# EAGLE design zerofat2 (EAGLE 7.5.0)
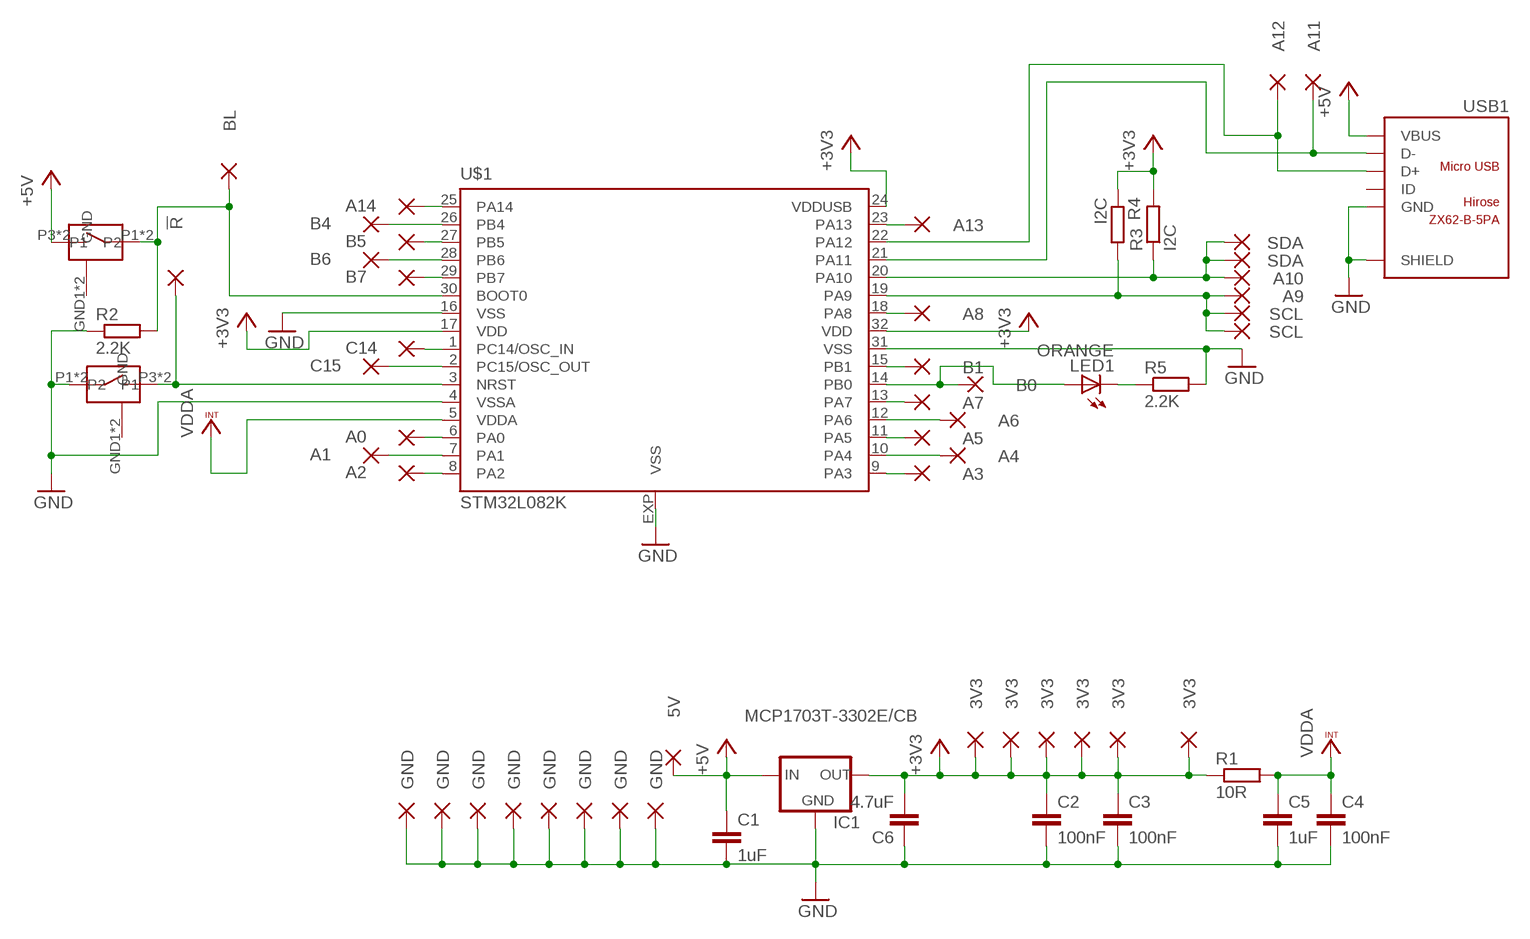
[diagram p0: schematic, sheet 1]

## Parts
B  EVQPT5A15  [EVQPT5A15]
C1  1uF  C-EUC0603  [C0603]
C2  100nF  C-EUC0603  [C0603]
C3  100nF  C-EUC0603  [C0603]
C4  100nF  C-EUC0603  [C0603]
C5  1uF  C-EUC0603  [C0603]
C6  4.7uF  C-EUC0603  [C0603]
IC1  MCP1703T-3302E/CB  XC63FPM  [SOT23]
LED1  ORANGE  LEDCHIP-LED0603  [CHIP-LED0603]
PAD1  SCL  SMD2  [PAD_MINIMAL]
PAD2  SDA  SMD2  [PAD_MINIMAL]
PAD3  C14  SMD2  [PAD_MINIMAL]
PAD4  C15  SMD2  [PAD_MINIMAL]
PAD5  GND  SMD2  [PAD_MINIMAL]
PAD6  !R  SMD2  [PAD_MINIMAL]
PAD7  3V3  SMD2  [PAD_MINIMAL]
PAD8  A0  SMD2  [PAD_MINIMAL]
PAD9  A2  SMD2  [PAD_MINIMAL]
PAD10  A1  SMD2  [PAD_MINIMAL]
PAD11  A3  SMD2  [PAD_MINIMAL]
PAD12  A5  SMD2  [PAD_MINIMAL]
PAD13  A7  SMD2  [PAD_MINIMAL]
PAD14  B1  SMD2  [PAD_MINIMAL]
PAD15  3V3  SMD2  [PAD_MINIMAL]
PAD16  A4  SMD2  [PAD_MINIMAL]
PAD17  A6  SMD2  [PAD_MINIMAL]
PAD18  B0  SMD2  [PAD_MINIMAL]
PAD19  SDA  SMD2  [PAD_MINIMAL]
PAD20  SCL  SMD2  [PAD_MINIMAL]
PAD21  3V3  SMD2  [PAD_MINIMAL]
PAD22  GND  SMD2  [PAD_MINIMAL]
PAD24  A8  SMD2  [PAD_MINIMAL]
PAD25  A9  SMD2  [PAD_MINIMAL]
PAD26  A10  SMD2  [PAD_MINIMAL]
PAD27  A13  SMD2  [PAD_MINIMAL]
PAD29  A12  SMD2  [PAD_MINIMAL]
PAD30  A11  SMD2  [PAD_MINIMAL]
PAD31  A14  SMD2  [PAD_MINIMAL]
PAD33  B5  SMD2  [PAD_MINIMAL]
PAD34  B7  SMD2  [PAD_MINIMAL]
PAD35  BL  SMD2  [PAD_MINIMAL]
PAD36  B6  SMD2  [PAD_MINIMAL]
PAD37  B4  SMD2  [PAD_MINIMAL]
PAD39  GND  SMD2  [PAD_MINIMAL]
PAD43  GND  SMD2  [PAD_MINIMAL]
PAD45  5V  SMD2  [PAD_MINIMAL]
PAD48  GND  SMD2  [PAD_MINIMAL]
PAD49  GND  SMD2  [PAD_MINIMAL]
PAD50  GND  SMD2  [PAD_MINIMAL]
PAD51  GND  SMD2  [PAD_MINIMAL]
PAD52  3V3  SMD2  [PAD_MINIMAL]
PAD53  3V3  SMD2  [PAD_MINIMAL]
PAD54  3V3  SMD2  [PAD_MINIMAL]
R  EVQPT5A15  [EVQPT5A15]
R1  10R  R-EU_R0603  [R0603]
R2  2.2K  R-EU_R0603  [R0603]
R3  I2C  R-EU_R0603  [R0603]
R4  I2C  R-EU_R0603  [R0603]
R5  2.2K  R-EU_R0603  [R0603]
U$1  STM32L082K  [UFQFPN32]
USB1  ZX62-B-5PA  MICRO-USB-SMD(ZX62-B-5PA)  [MICRO-USB5+6P-SMD-0.65-AB]

## Nets
+3V3 [PWR]: C2.1 C3.1 C6.2 IC1.2(OUT) PAD7.1(P) PAD15.1(P) PAD21.1(P) PAD52.1(P) PAD53.1(P) PAD54.1(P) R1.1 R3.2 R4.1 U$1.17(VDD) U$1.24(VDDUSB) U$1.32(VDD)
+5V: B.P3(P2) B.P4(P2) C1.1 IC1.3(IN) PAD45.1(P) USB1.1(VBUS)
BOOT0: B.P1 B.P2(P1) PAD35.1(P) R2.2 U$1.30(BOOT0)
GND: C1.2 C2.2 C3.2 C4.2 C5.2 C6.1 IC1.1(GND) PAD5.1(P) PAD22.1(P) PAD39.1(P) PAD43.1(P) PAD48.1(P) PAD49.1(P) PAD50.1(P) PAD51.1(P) R2.1 R5.2 R.P1 R.P2(P1) U$1.4(VSSA) U$1.16(VSS) U$1.31(VSS) U$1.EXP(VSS) USB1.5(GND) USB1.P1(SHIELD) USB1.P2(SHIELD) USB1.P3(SHIELD) USB1.P4(SHIELD) USB1.P5(SHIELD) USB1.P6(SHIELD)
N$1: PAD30.1(P) U$1.21(PA11) USB1.2(D-)
N$2: LED1.A PAD18.1(P) U$1.14(PB0)
N$3: PAD27.1(P) U$1.23(PA13)
N$4: PAD29.1(P) U$1.22(PA12) USB1.3(D+)
N$5: PAD31.1(P) U$1.25(PA14)
N$6: PAD3.1(P) U$1.1(PC14/OSC_IN)
N$7: PAD37.1(P) U$1.26(PB4)
N$8: PAD33.1(P) U$1.27(PB5)
N$9: PAD36.1(P) U$1.28(PB6)
N$10: PAD4.1(P) U$1.2(PC15/OSC_OUT)
N$11: PAD8.1(P) U$1.6(PA0)
N$12: PAD10.1(P) U$1.7(PA1)
N$13: PAD9.1(P) U$1.8(PA2)
N$14: PAD11.1(P) U$1.9(PA3)
N$15: PAD16.1(P) U$1.10(PA4)
N$16: PAD12.1(P) U$1.11(PA5)
N$17: PAD17.1(P) U$1.12(PA6)
N$18: PAD13.1(P) U$1.13(PA7)
N$19: PAD24.1(P) U$1.18(PA8)
N$20: PAD14.1(P) U$1.15(PB1)
N$21: PAD1.1(P) PAD20.1(P) PAD25.1(P) R4.2 U$1.19(PA9)
N$22: PAD34.1(P) U$1.29(PB7)
N$23: PAD2.1(P) PAD19.1(P) PAD26.1(P) R3.1 U$1.20(PA10)
N$41: LED1.C R5.1
N$45: PAD6.1(P) R.P3(P2) R.P4(P2) U$1.3(NRST)
VCCINT: C4.1 C5.1 R1.2 U$1.5(VDDA) ; supply symbol labelled VDDA
Unconnected: B.GND1(GND) B.GND2(GND) R.GND1(GND) R.GND2(GND) USB1.4(ID)

## Library data of the parts
B R = zerofat:EVQPT5A15: Panasonic EVQPT5A15 4.9 mm Square SMD Light Touch Switch
C1-C6 = rcl:C-EU: CAPACITOR, European symbol
IC1 = v-reg:XC63FP: Positiv Voltage Regulators www.torex.co.jp/english/product/pro02/pdf/0201_xc62fp.pdf
LED1 = led:LED: LED OSRAM: - CHIPLED LG R971, LG N971, LY N971, LG Q971, LY Q971, LO R971, LY R971 LH N974, LH R974 LS Q976, LO Q976, LY Q976 LO Q996 - Hyper CHIPLED LW Q18S LB Q993, LB Q99A, LB R99A - SideLED LS A670, LO A670, LY A670, LG A670, LP A670 LB A673, LV A673, LT A673, LW A673 LH A674 LY A675 LS A676, LA A676, LO A676, LY A676, LW A676 LS A679, LY A679, LG A679 - Hyper Micro SIDELED® LS Y876, LA Y876, LO Y876, LY Y876 LT Y87S - SmartLED LW L88C, LW L88S LB L89C, LB L89S, LG L890 LS L89K, LO L89K, LY L89K LS L896, LA L896, LO L896, LY L896 - TOPLED LS T670, LO T670, LY T670, LG T670, LP T670 LSG T670, LSP T670, LSY T670, LOP T670, LYG T670 LG T671, LOG T671, LSG T671 LB T673, LV T673, LT T673, LW T673 LH T674 LS T676, LA T676, LO T676, LY T676, LB T676, LH T676, LSB T676, LW T676 LB T67C, LV T67C, LT T67C, LS T67K, LO T67K, LY T67K, LW E67C LS E67B, LA E67B, LO E67B, LY E67B, LB E67C, LV E67C, LT E67C LW T67C LS T679, LY T679, LG T679 LS T770, LO T770, LY T770, LG T770, LP T770 LB T773, LV T773, LT T773, LW T773 LH T774 LS E675, LA E675, LY E675, LS T675 LS T776, LA T776, LO T776, LY T776, LB T776 LHGB T686 LT T68C, LB T68C - Hyper Mini TOPLED® LB M676 - Mini TOPLED Santana® LG M470 LS M47K, LO M47K, LY M47K Source: http://www.osram.convergy.de LUXEON: - LUMILED® LXK2-PW12-R00, LXK2-PW12-S00, LXK2-PW14-U00, LXK2-PW14-V00 LXK2-PM12-R00, LXK2-PM12-S00, LXK2-PM14-U00 LXK2-PE12-Q00, LXK2-PE12-R00, LXK2-PE12-S00, LXK2-PE14-T00, LXK2-PE14-U00 LXK2-PB12-K00, LXK2-PB12-L00, LXK2-PB12-M00, LXK2-PB14-N00, LXK2-PB14-P00, LXK2-PB14-Q00 LXK2-PR12-L00, LXK2-PR12-M00, LXK2-PR14-Q00, LXK2-PR14-R00 LXK2-PD12-Q00, LXK2-PD12-R00, LXK2-PD12-S00 LXK2-PH12-R00, LXK2-PH12-S00 LXK2-PL12-P00, LXK2-PL12-Q00, LXK2-PL12-R00 Source: www.luxeon.com KINGBRIGHT: KA-3528ASYC Source: www.kingbright.com
PAD1-PAD22 PAD24-PAD27 PAD29-PAD31 PAD33-PAD37 PAD39 PAD43 PAD45 PAD48-PAD54 = zerofat:SMD2: SMD PAD
R1-R5 = rcl:R-EU_: RESISTOR, European symbol
U$1 = zerofat:STM32L082K: STM32L082K[ZB] Ultra-low-power ARM Cortex M0 32MHz platform 1.65 V to 3.6 V power supply Up to 192 KB Flash + 20KB RAM + 6 KB EEPROM 2x 12-bit DACs + 2x comparators + 12bit ADC 7ch DMA, USB 2.0 crystal-less,3x USART, SPI 16, 2 x I2C 11x timers, 2x watchdogs, CRC, RNG, AES 128-bit
USB1 = Seeed-OPL-Connector:MICRO-USB-SMD(ZX62-B-5PA): 320010005; MPN: ZX62-B-5PA

## Net classes
0 default: width 0.2 mm
1 PWR: width 0.2 mm
2 GND: width 0.2 mm

## Board
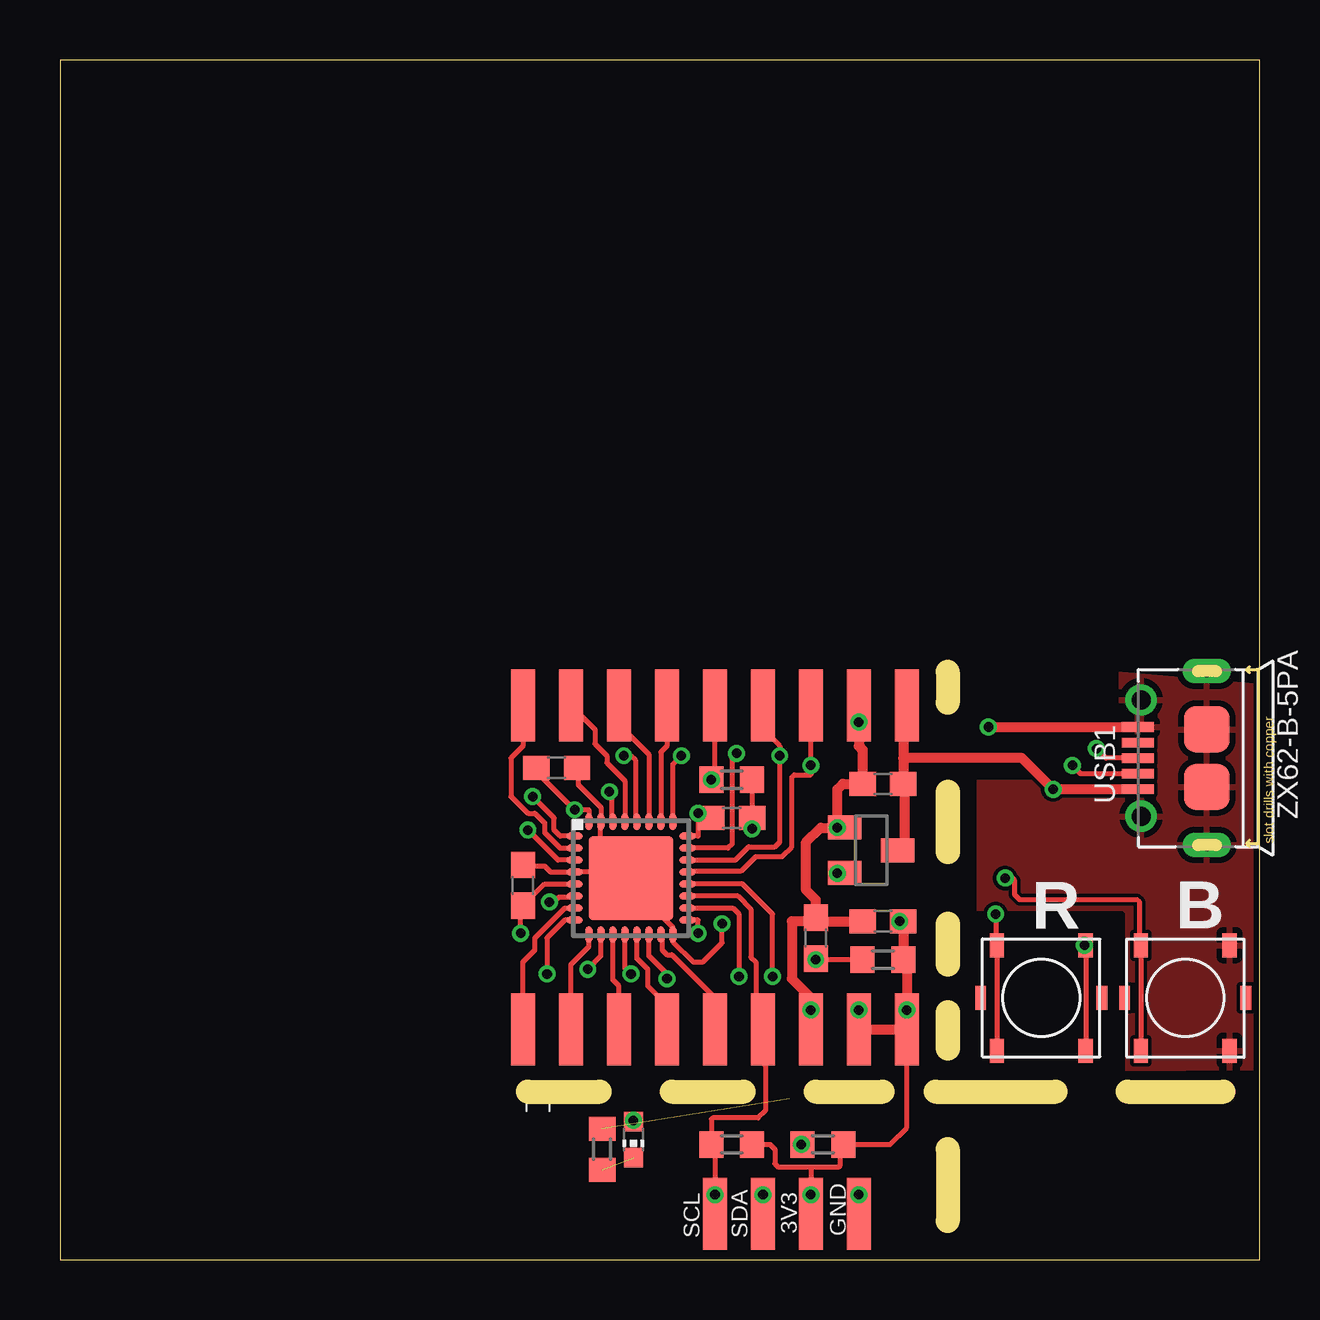
[diagram p1: board, top side]
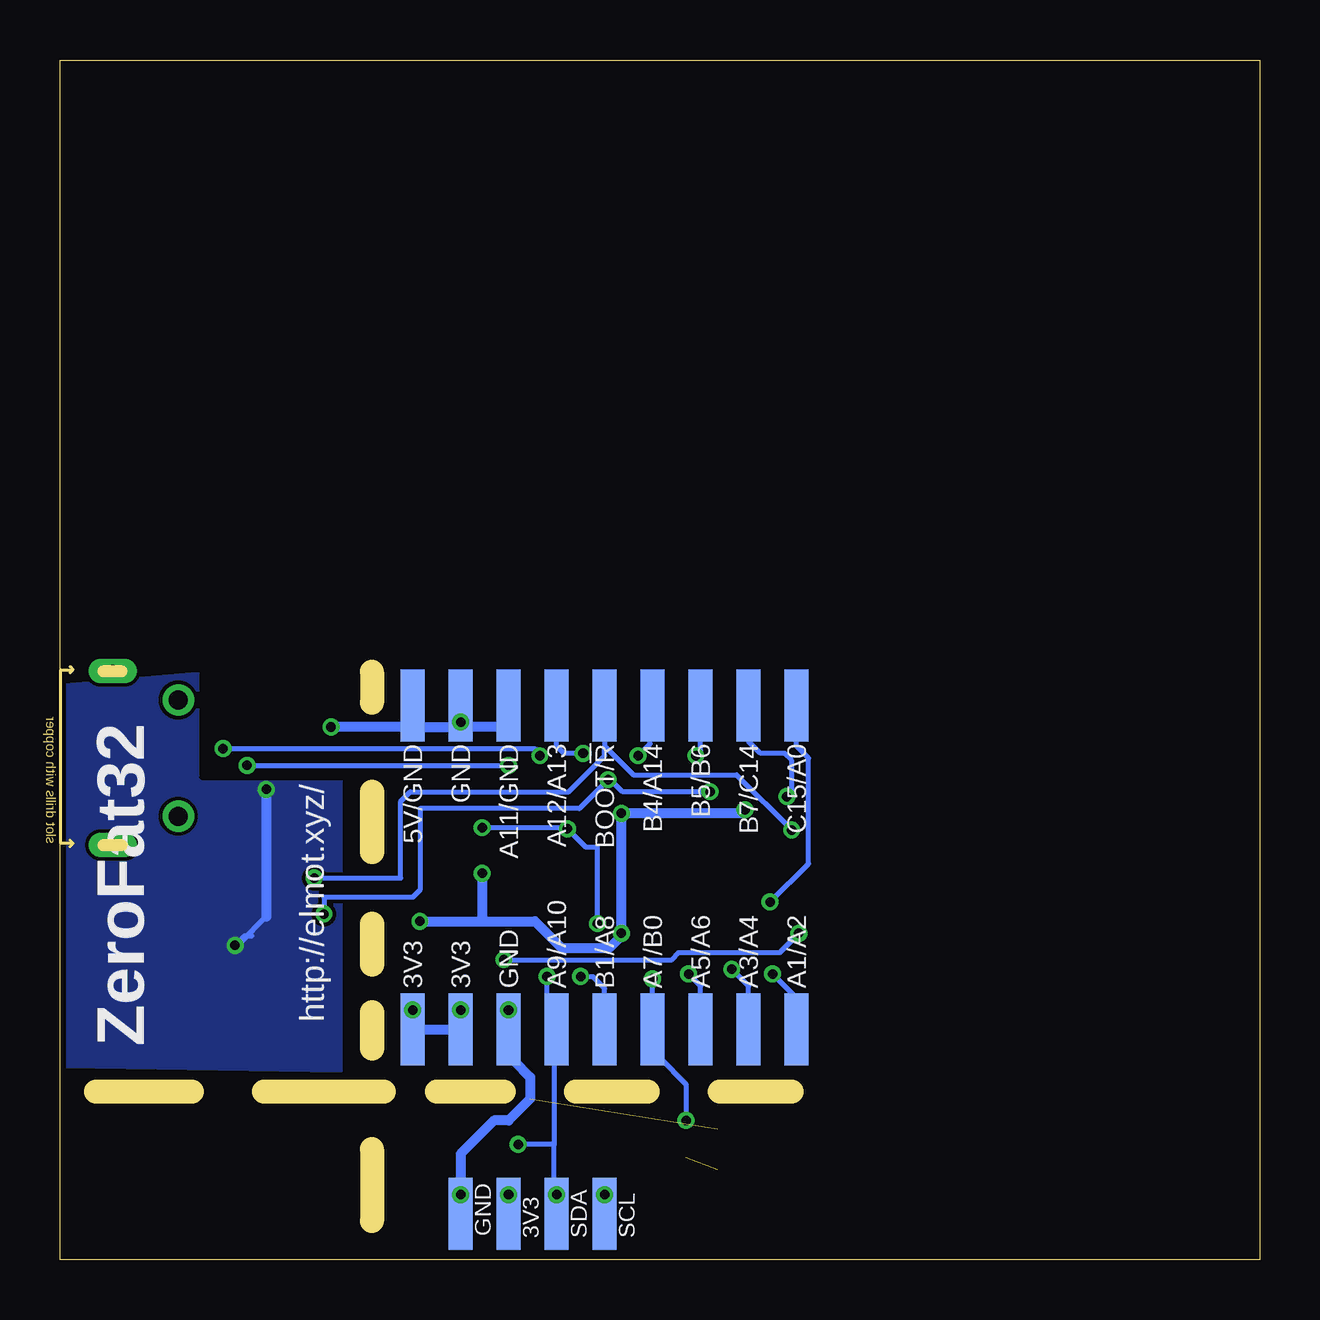
[diagram p2: board, bottom side, seen from below]

Size 50 x 50 mm. Coordinates in mm from the lower left corner, seen from the top.
Outline: 0,0 50,0 50,50 0,50 0,0
Copper layers (1*16): Top 0.035mm / dielectric 1.5mm / Bottom 0.035mm
Design rules "SeeedStudio_2layer_DRU_no_angle_20140221 *": minimum track width 6mil, minimum drill 12mil, track to track 6mil, track to pad 6mil, pad to pad 6mil, via to via 6mil, smd to smd 0mil, copper to edge 10mil, drill to drill 10mil, minimum pad ring 10mil, minimum via ring 6mil, stop-mask expansion 2mil, vias tented up to drill 100mil, thermal gap 10mil
Milling: 10 lines

### Footprints (pad centres in the part's own frame; a part is rotated, then mirrored left to right if it is on the bottom)
EVQPT5A15 = smd 0.45 x 1: GND1 -2.525,0; GND2 2.525,0 | smd 0.6 x 1: P1 -1.85,-2.2; P2 -1.85,2.2; P3 1.85,2.2; P4 1.85,-2.2
C0603 = smd 1.1 x 1: 1 -0.85,0; 2 0.85,0
SOT23 = smd 1 x 1.4: 1 -0.95,-1.1; 2 0.95,-1.1; 3 0,1.1
CHIP-LED0603 = smd 0.8 x 0.8: A 0,-0.75; C 0,0.75
PAD_MINIMAL = smd 1 x 3: 1 0,0
R0603 = smd 1 x 1.1: 1 -0.85,0; 2 0.85,0
UFQFPN32 = smd 0.7 x 0.3: 1 -2.35,1.75; 2 -2.35,1.25; 3 -2.35,0.75; 4 -2.35,0.25; 5 -2.35,-0.25; 6 -2.35,-0.75; 7 -2.35,-1.25; 8 -2.35,-1.75; 17 2.35,-1.75; 18 2.35,-1.25; 19 2.35,-0.75; 20 2.35,-0.25; 21 2.35,0.25; 22 2.35,0.75; 23 2.35,1.25; 24 2.35,1.75 | smd 0.3 x 0.7: 9 -1.75,-2.35; 10 -1.25,-2.35; 11 -0.75,-2.35; 12 -0.25,-2.35; 13 0.25,-2.35; 14 0.75,-2.35; 15 1.25,-2.35; 16 1.75,-2.35; 25 1.75,2.35; 26 1.25,2.35; 27 0.75,2.35; 28 0.25,2.35; 29 -0.25,2.35; 30 -0.75,2.35; 31 -1.25,2.35; 32 -1.75,2.35 | smd 3.5 x 3.5: EXP 0,0
MICRO-USB5+6P-SMD-0.65-AB = smd 0.4 x 1.35: 1 -1.3,2.875; 2 -0.65,2.875; 3 0,2.875; 4 0.65,2.875; 5 1.3,2.875 | smd 1.9 x 1.9: P1 -1.2,0; P2 1.2,0 | drill 0.508 pad 1.016 long: P3 -3.625,0; P4 3.625,0 | drill 0.8: P5 -2.425,2.73; P6 2.425,2.73

### Placement (x,y rotation side)
B  40.9,10.9 0 top
C1  34.3,19.83 180 top
C2  20.7,20.5 0 top
C3  28,18.4 0 top
C4  19.3,15.6 90 top
C5  31.5,13.4 90 top
C6  34.3,14.1 0 top
IC1  33.81,17.06 270 top
LED1  23.9,5 180 top
PAD1  27.3,1.9 0 top
PAD2  29.3,1.9 0 top
PAD3  21.3,23.1 0 bottom
PAD4  19.3,23.1 0 top
PAD5  35.3,23.1 0 bottom
PAD6  27.3,23.1 180 bottom
PAD7  35.3,9.6 0 bottom
PAD8  19.3,23.1 0 bottom
PAD9  19.3,9.6 0 bottom
PAD10  19.3,9.6 0 top
PAD11  21.3,9.6 180 top
PAD12  23.3,9.6 180 top
PAD13  25.3,9.6 180 top
PAD14  27.3,9.6 180 top
PAD15  35.3,9.6 0 top
PAD16  21.3,9.6 180 bottom
PAD17  23.3,9.6 180 bottom
PAD18  25.3,9.6 180 bottom
PAD19  29.3,1.9 0 bottom
PAD20  27.3,1.9 0 bottom
PAD21  31.3,1.9 0 bottom
PAD22  33.3,1.9 0 bottom
PAD24  27.3,9.6 180 bottom
PAD25  29.3,9.6 180 top
PAD26  29.3,9.6 180 bottom
PAD27  29.3,23.1 180 bottom
PAD29  29.3,23.1 180 top
PAD30  31.3,23.1 180 top
PAD31  25.3,23.1 0 bottom
PAD33  23.3,23.1 0 top
PAD34  21.3,23.1 0 top
PAD35  27.3,23.1 0 top
PAD36  23.3,23.1 0 bottom
PAD37  25.3,23.1 0 top
PAD39  33.3,23.1 0 bottom
PAD43  31.3,9.6 0 top
PAD45  35.3,23.1 0 top
PAD48  31.3,9.6 0 bottom
PAD49  33.3,23.1 0 top
PAD50  31.3,23.1 0 bottom
PAD51  33.3,1.9 0 top
PAD52  33.3,9.6 180 top
PAD53  33.3,9.6 180 bottom
PAD54  31.3,1.9 180 top
R  46.9,10.9 180 top
R1  34.3,12.5 180 top
R2  28,20 180 top
R3  31.8,4.8 0 top
R4  28,4.8 180 top
R5  22.6,4.6 90 top
U$1  23.8,15.9 0 top
USB1  47.8,20.9 90 top

### Tracks (layer width: path | path; a pad name or v marks a point on that pad's centre or on a via)
+3V3  (via drill 0.4)
  Top 0.2: 26.2,14.2 U$1.17 26.6,14.15 v26.6,13.6 | U$1.32 22.05,18.75 v21.45,18.75 19.85,20.35 C2.1 | U$1.24 26.6,17.65 v26.6,18.6 26.95,18.6 C3.1 | PAD52.1 v33.3,10.4 33.15,10.55 | C6.2 v35,14.1 | R1.1 35.3,12.35 | IC1.2 v32.4,16.1 | PAD21.1 v31.3,2.7 31.3,3.85 | 31.3,3.85 32.45,3.85 32.5,3.9 32.5,4.65 R3.2 34.6,4.8 35.3,5.5 PAD15.1 | 31.3,3.85 29.95,3.85 29.8,4 29.8,4.6 29.6,4.8 R4.1
  Top 0.406: C6.2 R1.1 | 35.3,12.35 v35.3,10.4 | PAD52.1 PAD15.1
  Top 1: PAD15.1 v35.3,10.4
  Bottom 0.2: 26.6,18.2 v26.6,18.6 | v33.3,10.4 PAD52.1 | 26.6,13.5 v26.6,13.6 | PAD21.1 v31.3,2.7
  Bottom 0.406: v26.6,13.6 v26.6,18.6 21.6,18.6 v21.45,18.75 | v35,14.1 32.4,14.1 | 32.4,14.1 30.2,14.1 29.1,13 27.1,13 26.6,13.5 | v32.4,16.1 32.4,14.1 | PAD15.1 PAD52.1
+5V  (via drill 0.4)
  Top 0.2: 35.2,19.78 C1.1 arc90 35.38,19.6 | IC1.3 35.2,17.35 | PAD45.1 35.15,22.95 | B.P4 B.P3 42.75,13.35 42.8,13.4
  Top 0.406: 35.2,19.78 35.2,17.35 | 35.15,22.95 35.15,20.9 | 35.15,20.9 C1.1 | USB1.1 v41.4,19.6 40.1,20.9 35.15,20.9 | 42.6,13.1 v42.7,13.1 B.P3
  Bottom 0.2: 41.4,14.3 42.5,13.2 42.5,13 | v42.7,13.1 42.3,13.5 42,13.5
  Bottom 0.406: v41.4,19.6 41.4,14.3
  pour Bottom: 38.3,24.9 49.8,23.9 49.8,8.1 38.3,7.9
BOOT0  (via drill 0.4)
  Top 0.2: U$1.30 23,18.3 23,19.4 v22.9,19.5 | PAD35.1 27.3,20.25 27.15,20.1 R2.2 | B.P1 B.P2 39,13.1 v39,14.4
  Bottom 0.2: v22.9,19.5 26.55,19.5 27.05,20 R2.2 28.35,18.8 35,18.8 35,15.4 35.3,15.1 39,15.1 v39,14.4
  other vias: 27.15,20
GND  (via drill 0.4)  (1 unrouted)
  Top 0.2: U$1.4 arc90 21.4,16.2 | 22.5,16.15 23.55,16.15 U$1.EXP 24.3,15.4 24.3,15.1 25.55,13.85 U$1.16 25.55,13.25 26.4,12.4 26.8,12.4 27.6,13.2 v27.6,14 | 22.5,16.15 U$1.4 | 22.5,16.15 22.5,18.2 U$1.31 22.55,18.85 21.6,19.8 21.6,20.45 C2.2 | C4.2 19.35,16.4 20.2,16.4 20.45,16.15 U$1.4 | R2.1 C3.2 | 31.5,14 31.45,14.05 31.45,14.2 C5.2 31.65,14.1 | C3.2 28.85,18.35 | v32.39,18.01 IC1.1 | v33.3,22.4 PAD49.1 | v28.85,17.95 C3.2 | v31.3,10.4 PAD43.1 | PAD22.1 v33.3,2.7
  Top 0.406: 31.65,14.1 C6.1 | PAD49.1 33.3,21.4 33.45,21.25 C1.2 32.63,19.83 32.4,19.6 v32.4,18 | C5.2 31.5,15 31.1,15.4 31.1,17.4 31.7,18 v32.4,18 | v38.7,22.2 USB1.5 | v32.4,18 v32.4,18.01 IC1.1 | 31.5,14 31.4,14.1 30.5,14.1 30.5,11.7 31.3,10.9 v31.3,10.4
  Bottom 0.2: v27.6,14 27.6,17.2 28.1,17.2 v28.85,17.95 28.9,18 v32.4,18 | PAD49.1 v33.3,22.4 | v31.3,10.4 PAD43.1 31.1,9.4 | v33.3,2.7 PAD22.1
  Bottom 0.406: 35.3,22.2 v38.7,22.2 | PAD5.1 35.3,22.2 | 35.3,22.2 33.5,22.2 | 33.5,22.2 arc-90 v33.3,22.4 | PAD50.1 31.3,22.2 33.5,22.2 | 31.1,9.4 31.1,8.3 30.4,7.6 30.4,6.7 31.3,5.8 31.9,5.8 33.3,4.4 v33.3,2.7
  pour Top: 49.8,23.9 38.3,24.9 38.3,7.9 49.8,8
  pour Top: 22.3,17.4 25.3,17.4 25.3,14.4 22.3,14.4
N$1  (via drill 0.4)
  Top 0.2: U$1.21 26.2,16.2 28.4,16.2 29,16.8 30.1,16.8 30.5,17.2 30.5,20.1 30.6,20.2 31.3,20.2 v31.3,20.6 PAD30.1 | USB1.2 42.55,20.25 v42.2,20.6
  Bottom 0.2: v42.2,20.6 v31.3,20.6
N$2  (via drill 0.4)
  Top 0.2: U$1.14 24.55,12.65 25.3,11.9 v25.3,11.7 | v23.9,5.8 LED1.A
  Bottom 0.2: v25.3,11.7 PAD18.1 25,9.3 25,8.4 23.9,7.3 v23.9,5.8
N$3  (via drill 0.4)
  Top 0.2: 26.2,17.1 U$1.23 27.85,17.15 28,17.3 28,20.9 v28.2,21.1
  Bottom 0.2: PAD27.1 29.3,21.4 29,21.1 v28.2,21.1
N$4  (via drill 0.4)
  Top 0.2: U$1.22 28.15,16.65 28.7,17.2 29.8,17.2 30,17.4 v30,21 30,21.4 29.3,22.1 PAD29.1 | USB1.3 43.6,20.9 v43.2,21.3
  Bottom 0.2: v43.2,21.3 30.2,21.3 30,21.1 v30,21
N$5  (via drill 0.4)
  Top 0.2: U$1.25 25.55,20.65 v25.9,21
  Bottom 0.2: v25.9,21 25.4,21.5 25.4,23 PAD31.1
N$6  (via drill 0.4)
  Top 0.2: U$1.1 20.85,17.65 20.6,17.9 20.6,18.4 v19.7,19.3
  Bottom 0.2: PAD3.1 21.3,21.6 20.8,21.1 19.8,21.1 19.5,20.8 19.5,19.5 v19.7,19.3
N$7
  Top 0.2: PAD37.1 25.3,21.4 25.05,21.15 U$1.26
N$8
  Top 0.2: U$1.27 24.55,21.05 23.3,22.3 PAD33.1
N$9  (via drill 0.4)
  Top 0.2: U$1.28 24,18.3 24,20.8 23.8,21 v23.5,21
  Bottom 0.2: v23.5,21 23.3,21.2 PAD36.1
N$10
  Top 0.2: PAD4.1 19.3,21.4 18.8,20.9 18.8,19.3 19.5,18.6 19.8,18.6 20.2,18.2 20.2,17.8 20.85,17.15 U$1.2
N$11  (via drill 0.4)
  Top 0.2: U$1.6 21.4,15.1 20.8,15.1 20.6,14.9 v20.4,14.9
  Bottom 0.2: v20.4,14.9 18.8,16.5 18.8,20.9 19.3,21.4 PAD8.1
N$12
  Top 0.2: PAD10.1 19.3,12.4 19.8,12.9 19.8,13.4 21.05,14.65 U$1.7
N$13  (via drill 0.4)
  Top 0.2: U$1.8 21.05,14.15 20.3,13.4 v20.3,11.9
  Bottom 0.2: v20.3,11.9 19.3,10.9 PAD9.1
N$14
  Top 0.2: PAD11.1 21.3,12.3 22.05,13.05 U$1.9
N$15  (via drill 0.4)
  Top 0.2: v22,12.1 22.55,12.65 U$1.10
  Bottom 0.2: PAD16.1 21.3,11.4 v22,12.1
N$16
  Top 0.2: PAD12.1 23.3,11.4 23.05,11.65 U$1.11
N$17  (via drill 0.4)
  Top 0.2: v23.8,11.9 23.55,12.15 U$1.12
  Bottom 0.2: PAD17.1 23.3,11.4 v23.8,11.9
N$18
  Top 0.2: PAD13.1 25.3,10.6 24.5,11.4 24.5,12.1 24.05,12.55 U$1.13
N$19  (via drill 0.4)
  Top 0.2: U$1.18 28.05,14.65 28.3,14.4 v28.3,11.8
  Bottom 0.2: PAD24.1 27.3,11.3 27.8,11.8 v28.3,11.8
N$20
  Top 0.2: U$1.15 25.1,13.5 25.1,12.9 25.3,12.7 25.5,12.7 27.3,10.9 PAD14.1
N$21  (via drill 0.4)
  Top 0.2: U$1.19 28.25,15.15 28.8,14.6 28.8,12.6 29,12.4 29,10.4 29.3,10.1 PAD25.1 29.3,8.2 29.4,8.1 29.4,6.2 29.1,5.9 27.2,5.9 27.15,5.85 R4.2 27.3,4.65 v27.3,2.7 PAD20.1 27.45,1.9
  Bottom 0.2: v27.3,2.7 PAD20.1
N$22
  Top 0.2: PAD34.1 22.3,22.1 22.3,21.5 22.8,21 22.8,20.7 23.55,19.95 U$1.29
N$23  (via drill 0.4)
  Top 0.2: U$1.20 28.45,15.65 29.7,14.4 v29.7,11.8 | v29.3,2.7 PAD19.1 | v30.9,4.8 R3.1
  Bottom 0.2: v29.7,11.8 29.7,11 29.3,10.6 PAD26.1 29.4,9.5 29.4,4.8 | PAD19.1 v29.3,2.7 29.4,2.8 29.4,4.8 | 29.4,4.8 v30.9,4.8
N$24
  cutout Top: 44.3,14.4 38.3,14.4 38.3,7.9 44.3,7.9
N$25
  cutout Top: 38.3,24.9 44,24.9 44,20.1 38.3,20.1
N$26
  cutout Bottom: 38.3,24.9 44.1,24.9 44.1,20.1 38.3,20.1
N$41  (1 unrouted)
N$45  (via drill 0.4)
  Top 0.2: U$1.3 20.75,16.65 v19.5,17.9 | R.P3 R.P4 45,13.15 45,14.9 44.9,15 40,15 39.8,15.2 39.8,15.8 39.7,15.9 v39.4,15.9
  Bottom 0.2: PAD6.1 27.3,21.4 | 27.3,21.4 26.1,20.2 21.8,20.2 v19.5,17.9 | v39.4,15.9 35.8,15.9 35.8,19.1 35.4,19.5 28.8,19.5 27.3,21 27.3,21.4
VCCINT  (via drill 0.4)
  Top 0.2: U$1.5 20.2,15.65 C4.1 19.2,14.65 v19.2,13.6 | R1.2 31.55,12.5
  Top 0.406: 31.55,12.5 v31.5,12.5 C5.1
  Bottom 0.2: v19.2,13.6 20,12.8 24.2,12.8 24.5,12.5 31.45,12.5
  Bottom 0.406: 31.45,12.5 v31.5,12.5

### Text on the board
tNames: R | B | |>|
bNames: C15/A0 | B7/C14 | B5/B6 | B4/A14 | BOOT/!R | A12/A13 | A11/GND | GND | 5V/GND | A1/A2 | A3/A4 | A5/A6 | A7/B0 | B1/A8 | A9/A10 | GND | 3V3 | 3V3 | http://elmot.xyz/ | ZeroFat32
bValues: 4x / 100nF
bStop: (c)elmot